# EAGLE design Ctrl_core_bluepillf3 (EAGLE 9.2.2)
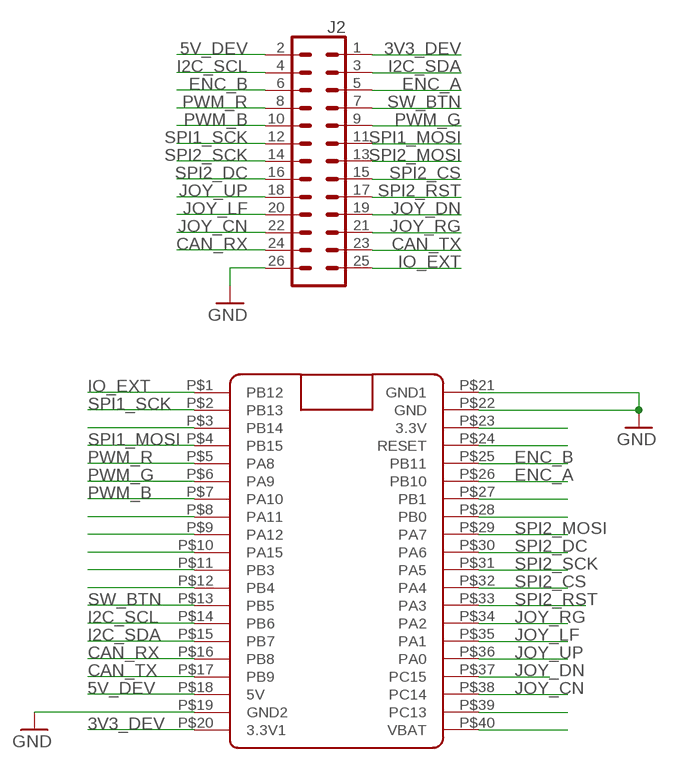
[diagram p0: schematic, sheet 1]

## Parts
J2  CONN_13X22X13  [2X13]
U$1  BLUE_PILL  [BLUE_PILL]

## Nets
3V3_DEV: J2.1 U$1.P$20(3.3V1)
5V_DEV: J2.2 U$1.P$18(5V)
CAN_RX: J2.24 U$1.P$16(PB8)
CAN_TX: J2.23 U$1.P$17(PB9)
ENC_A: J2.5 U$1.P$26(PB10)
ENC_B: J2.6 U$1.P$25(PB11)
GND: J2.26 U$1.P$19(GND2) U$1.P$21(GND1) U$1.P$22(GND)
I2C_SCL: J2.4 U$1.P$14(PB6)
I2C_SDA: J2.3 U$1.P$15(PB7)
IO_EXT: J2.25 U$1.P$1(PB12)
JOY_CN: J2.22 U$1.P$38(PC14)
JOY_DN: J2.19 U$1.P$37(PC15)
JOY_LF: J2.20 U$1.P$35(PA1)
JOY_RG: J2.21 U$1.P$34(PA2)
JOY_UP: J2.18 U$1.P$36(PA0)
N$2: U$1.P$27(PB1)
N$3: U$1.P$3(PB14)
N$4: U$1.P$23(3.3V)
N$8: U$1.P$8(PA11)
N$9: U$1.P$9(PA12)
N$10: U$1.P$10(PA15)
N$11: U$1.P$11(PB3)
N$12: U$1.P$12(PB4)
N$22: U$1.P$40(VBAT)
N$23: U$1.P$39(PC13)
N$34: U$1.P$28(PB0)
N$41: U$1.P$24(RESET)
PWM_B: J2.10 U$1.P$7(PA10)
PWM_G: J2.9 U$1.P$6(PA9)
PWM_R: J2.8 U$1.P$5(PA8)
SPI1_MOSI: J2.11 U$1.P$4(PB15)
SPI1_SCK: J2.12 U$1.P$2(PB13)
SPI2_CS: J2.15 U$1.P$32(PA4)
SPI2_DC: J2.16 U$1.P$30(PA6)
SPI2_MOSI: J2.13 U$1.P$29(PA7)
SPI2_RST: J2.17 U$1.P$33(PA3)
SPI2_SCK: J2.14 U$1.P$31(PA5)
SW_BTN: J2.7 U$1.P$13(PB5)

## Library data of the parts
J2 = Ctrl:CONN_13X2: Multi connection point. Often used as Generic Header-pin footprint for 0.1 inch spaced/style header connections On any of the 0.1 inch spaced packages, you can populate with these: Break Away Headers - Straight <https://www.sparkfun.com/products/116> (PRT-00116) Break Away Male Headers - Right Angle <https://www.sparkfun.com/products/553> (PRT-00553) Female Headers <https://www.sparkfun.com/products/115> (PRT-00115) Break Away Headers - Machine Pin <https://www.sparkfun.com/products/117> (PRT-00117) Break Away Female Headers - Swiss Machine Pin <https://www.sparkfun.com/products/743> (PRT-00743)
U$1 = BluePill:BLUE_PILL

## Board
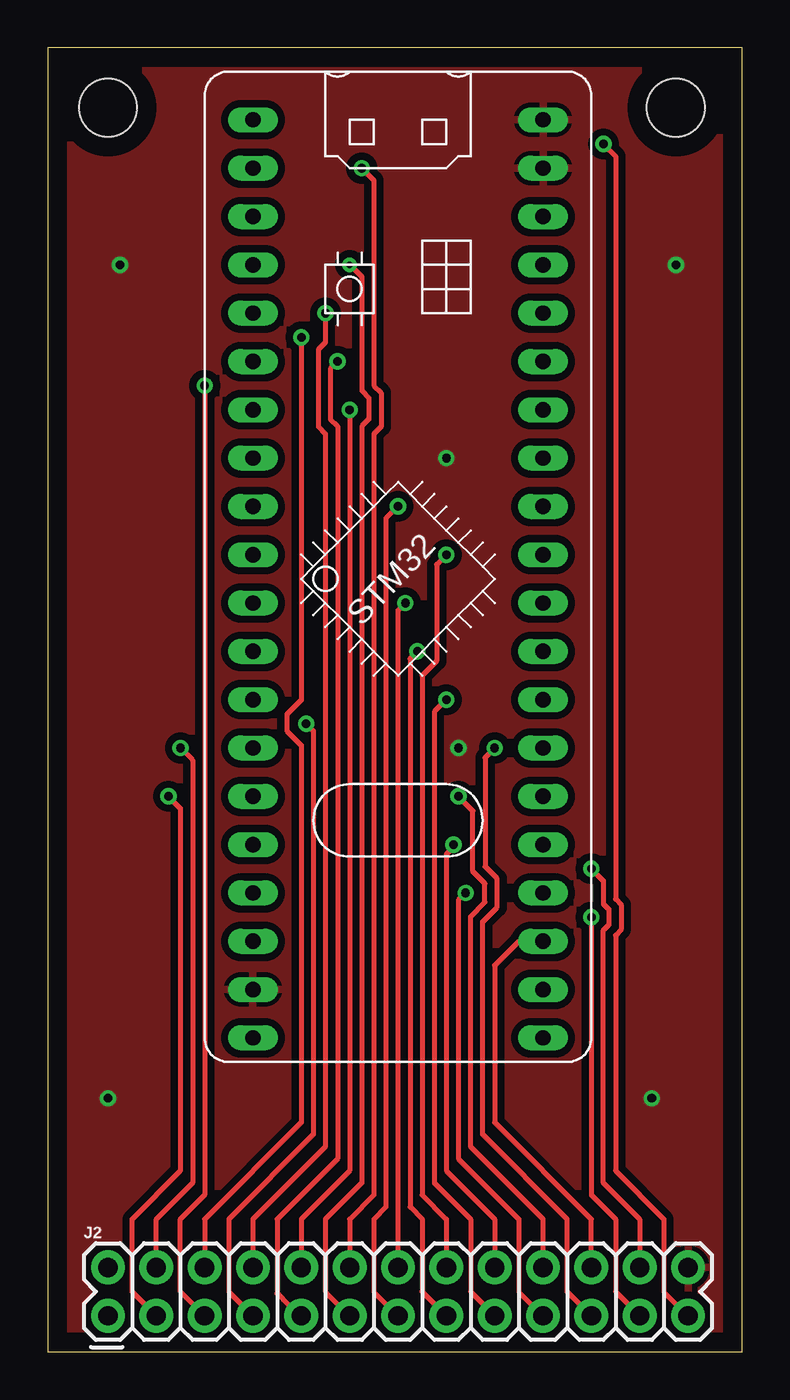
[diagram p1: board, top side]
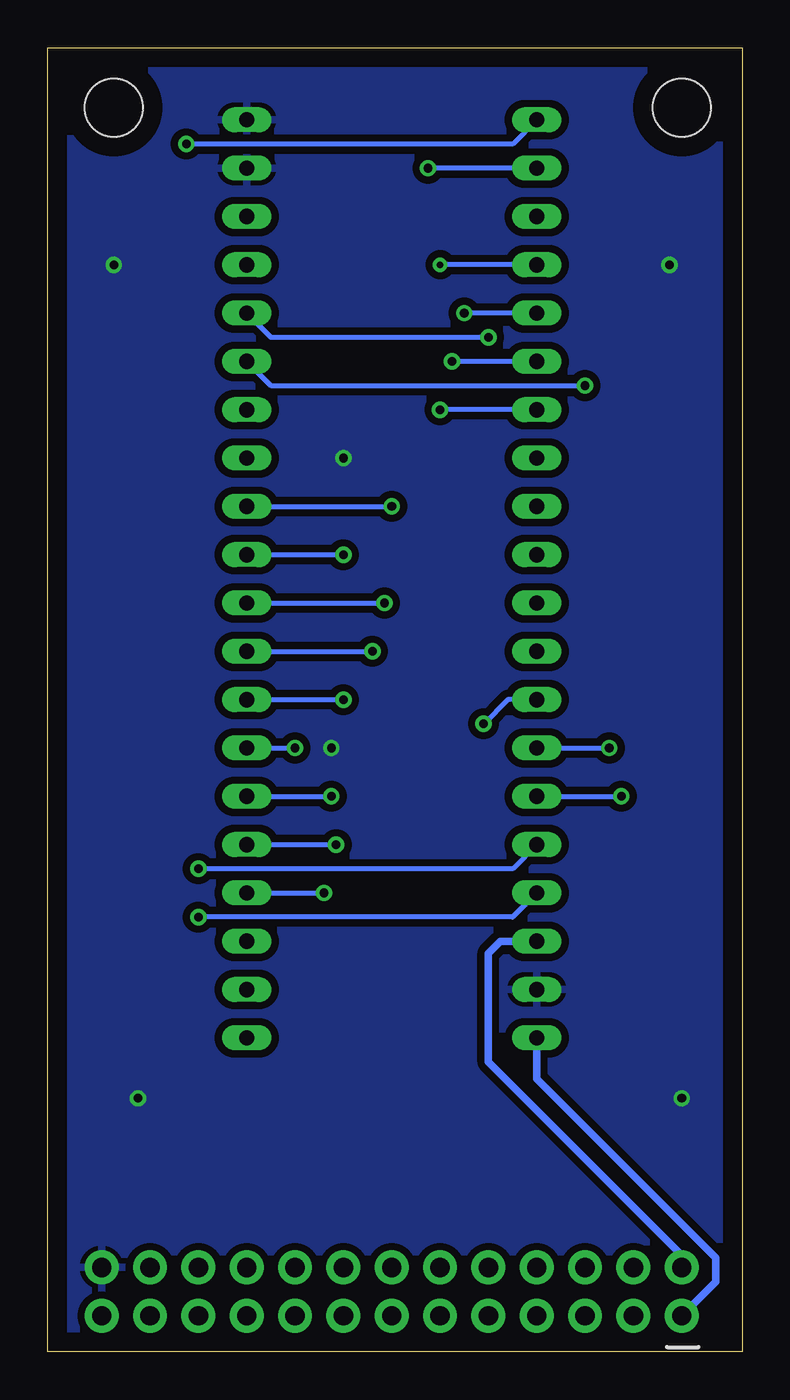
[diagram p2: board, bottom side, seen from below]

Size 36.5 x 68.57 mm. Coordinates in mm from the lower left corner, seen from the top.
Outline: 0,0 36.5,0 36.5,68.57 0,68.57 0,0
Copper layers (1*16): Top 0.035mm / dielectric 1.5mm / Bottom 0.035mm
Design rules "default *": minimum track width 6mil, minimum drill 0.35mm, track to track 15mil, track to pad 15mil, pad to pad 15mil, via to via 15mil, smd to smd 10mil, copper to edge 40mil, drill to drill 10mil, minimum pad ring 10mil, minimum via ring 8mil, stop-mask expansion 4mil, vias tented up to drill 0mil, thermal gap 10mil
Holes 3.05 mm at 3.17,65.41 33.02,65.41

### Footprints (pad centres in the part's own frame; a part is rotated, then mirrored left to right if it is on the bottom)
2X13 = drill 1.016 pad 1.778: 1 0,0; 2 0,2.54; 3 2.54,0; 4 2.54,2.54; 5 5.08,0; 6 5.08,2.54; 7 7.62,0; 8 7.62,2.54; 9 10.16,0; 10 10.16,2.54; 11 12.7,0; 12 12.7,2.54; 13 15.24,0; 14 15.24,2.54; 15 17.78,0; 16 17.78,2.54; 17 20.32,0; 18 20.32,2.54; 19 22.86,0; 20 22.86,2.54; 21 25.4,0; 22 25.4,2.54; 23 27.94,0; 24 27.94,2.54; 25 30.48,0; 26 30.48,2.54
BLUE_PILL = drill 0.8 long: P$1 -7.62,15.24; P$2 -7.62,12.7; P$3 -7.62,10.16; P$4 -7.62,7.62; P$5 -7.62,5.08; P$6 -7.62,2.54; P$7 -7.62,0; P$8 -7.62,-2.54; P$9 -7.62,-5.08; P$10 -7.62,-7.62; P$11 -7.62,-10.16; P$12 -7.62,-12.7; P$13 -7.62,-15.24; P$14 -7.62,-17.78; P$15 -7.62,-20.32; P$16 -7.62,-22.86; P$17 -7.62,-25.4; P$18 -7.62,-27.94; P$19 -7.62,-30.48; P$20 -7.62,-33.02; P$21 7.62,15.24; P$22 7.62,12.7; P$23 7.62,10.16; P$24 7.62,7.62; P$25 7.62,5.08; P$26 7.62,2.54; P$27 7.62,0; P$28 7.62,-2.54; P$29 7.62,-5.08; P$30 7.62,-7.62; P$31 7.62,-10.16; P$32 7.62,-12.7; P$33 7.62,-15.24; P$34 7.62,-17.78; P$35 7.62,-20.32; P$36 7.62,-22.86; P$37 7.62,-25.4; P$38 7.62,-27.94; P$39 7.62,-30.48; P$40 7.62,-33.02

### Placement (x,y rotation side)
J2  3.17,1.91 0 top
U$1  18.41,49.53 0 top

### Tracks (layer width: path | path; a pad name or v marks a point on that pad's centre or on a via)
3V3_DEV
  Bottom 0.406: J2.1 1.4,3.68 1.4,4.95 10.79,14.35 U$1.P$20
5V_DEV
  Bottom 0.406: J2.2 3.17,5.08 13.34,15.24 13.34,20.95 12.7,21.59 U$1.P$18
CAN_RX  (via drill 0.45)
  Top 0.254: J2.24 31.12,6.99 29.21,8.89 29.21,22.17 29.51,22.47 29.51,23.25 29.21,23.55 29.21,24.76 v28.58,25.4
  Bottom 0.254: U$1.P$16 12.07,25.4 v28.58,25.4
CAN_TX  (via drill 0.45)
  Top 0.254: J2.23 29.84,3.17 29.84,6.99 28.58,8.26 v28.58,22.86
  Bottom 0.254: U$1.P$17 12.07,22.86 v28.58,22.86
ENC_A  (via drill 0.45)
  Top 0.254: J2.5 6.98,3.17 6.98,6.99 8.25,8.26 v8.25,50.8
  Bottom 0.254: U$1.P$26 24.77,50.8 v8.25,50.8
ENC_B  (via drill 0.45)
  Top 0.254: J2.6 8.25,6.99 13.34,12.06 13.34,31.89 12.58,32.65 12.58,33.51 13.34,34.27 v13.34,53.34
  Bottom 0.254: U$1.P$25 24.77,53.34 v13.34,53.34
GND  (via drill 0.45)
  other vias: 21.59,31.75 20.95,46.99 31.75,13.34 3.17,13.34 3.81,57.15 33.02,57.15
  pour Top: 0,68.58 36.83,68.58 36.83,0 0,0
  pour Bottom: 0,68.58 36.83,68.58 36.83,0 0,0
I2C_SCL  (via drill 0.45)
  Top 0.254: J2.4 5.71,6.99 7.62,8.89 7.62,31.11 v6.98,31.75
  Bottom 0.254: U$1.P$14 v6.98,31.75
I2C_SDA  (via drill 0.45)
  Top 0.254: v6.35,29.21 6.98,28.57 6.98,9.53 4.45,6.99 4.45,3.17 J2.3
  Bottom 0.254: U$1.P$15 v6.35,29.21
IO_EXT  (via drill 0.45)
  Top 0.254: J2.25 32.38,3.17 32.38,6.99 29.84,9.53 29.84,21.91 30.15,22.21 30.15,23.51 29.84,23.81 29.84,62.87 v29.21,63.5
  Bottom 0.254: U$1.P$1 12.07,63.5 v29.21,63.5
JOY_CN
  Top 0.254: J2.22 28.58,6.99 23.5,12.06 23.5,20.32 24.77,21.59 U$1.P$38
JOY_DN  (via drill 0.45)
  Top 0.254: J2.19 24.77,3.17 24.77,6.99 21.59,10.16 21.59,23.75 v21.97,24.13
  Bottom 0.254: U$1.P$37 v21.97,24.13
JOY_LF  (via drill 0.45)
  Top 0.254: J2.20 26.04,6.99 22.23,10.79 22.23,22.88 22.98,23.64 22.98,24.62 22.35,25.26 22.35,28.45 v21.59,29.21
  Bottom 0.254: U$1.P$35 v21.59,29.21
JOY_RG  (via drill 0.45)
  Top 0.254: J2.21 27.3,3.17 27.3,6.99 22.86,11.43 22.86,22.61 23.62,23.37 23.62,24.89 22.99,25.52 22.99,31.24 v23.5,31.75
  Bottom 0.254: U$1.P$34 v23.5,31.75
JOY_UP  (via drill 0.45)
  Top 0.254: J2.18 23.5,6.99 20.95,9.53 20.95,26.16 21.34,26.54 v21.34,26.67
  Bottom 0.254: U$1.P$36 v21.34,26.67
PWM_B  (via drill 0.45)
  Top 0.254: v15.88,49.53 15.88,9.53 13.34,6.99 J2.10
  Bottom 0.254: U$1.P$7 v15.88,49.53
PWM_G  (via drill 0.45)
  Top 0.254: J2.9 13.21,1.91 12.07,3.07 12.07,6.99 15.24,10.16 15.24,48.66 14.86,49.04 14.86,51.69 v15.24,52.07
  Bottom 0.254: U$1.P$6 v15.24,52.07
PWM_R  (via drill 0.45)
  Top 0.254: J2.8 10.79,6.99 14.61,10.79 14.61,48.26 14.23,48.64 14.23,52.69 14.61,53.07 v14.61,54.61
  Bottom 0.254: U$1.P$5 v14.61,54.61
SPI1_MOSI  (via drill 0.35)
  Top 0.254: J2.11 14.61,3.17 14.61,6.99 16.51,8.89 16.51,48.66 16.89,49.04 16.89,50.15 16.51,50.53 16.51,56.52 v15.88,57.15
  Bottom 0.254: U$1.P$4 v15.88,57.15
SPI1_SCK  (via drill 0.45)
  Top 0.254: J2.12 15.88,6.99 17.14,8.26 17.14,48.26 17.53,48.64 17.53,50.42 17.14,50.8 17.14,61.59 v16.51,62.23
  Bottom 0.254: U$1.P$2 v16.51,62.23
SPI2_CS  (via drill 0.45)
  Top 0.254: J2.15 19.68,3.17 19.68,6.99 19.05,7.62 19.05,36.45 v19.43,36.83
  Bottom 0.254: U$1.P$32 v19.43,36.83
SPI2_DC  (via drill 0.45)
  Top 0.254: J2.16 20.95,6.99 19.68,8.26 19.68,35.56 20.45,36.32 20.45,41.4 v20.95,41.91
  Bottom 0.254: U$1.P$30 v20.95,41.91
SPI2_MOSI  (via drill 0.45)
  Top 0.254: J2.13 17.14,3.17 17.14,6.99 17.78,7.62 17.78,43.82 v18.41,44.45
  Bottom 0.254: U$1.P$29 v18.41,44.45
SPI2_RST  (via drill 0.45)
  Top 0.254: J2.17 22.23,3.17 22.23,6.99 20.32,8.89 20.32,33.66 v20.95,34.29
  Bottom 0.254: U$1.P$33 v20.95,34.29
SPI2_SCK  (via drill 0.45)
  Top 0.254: v18.8,39.37 18.41,38.99 J2.14
  Bottom 0.254: U$1.P$31 v18.8,39.37
SW_BTN  (via drill 0.45)
  Top 0.254: J2.7 9.53,3.17 9.53,6.99 13.97,11.43 13.97,32.64 v13.59,33.02
  Bottom 0.254: U$1.P$13 12.32,34.29 v13.59,33.02

### Text on the board
Document: Patrik Marcacci 2018 / CTRL_Core_BluepillF3 v1.0 | GND